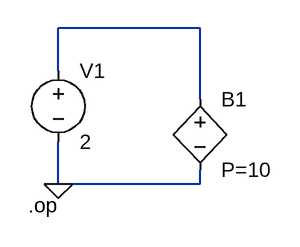
[diagram p0: schematic Constant-Power-Load.asc]
Constant-Power-Load.asc, the LTspice schematic file:
Version 4
SHEET 1 880 680
WIRE 176 64 16 64
WIRE 16 112 16 64
WIRE 176 144 176 64
WIRE 16 240 16 192
WIRE 176 240 176 224
WIRE 176 240 16 240
FLAG 16 240 0
SYMBOL voltage 16 96 R0
WINDOW 123 0 0 Left 0
WINDOW 39 0 0 Left 0
SYMATTR InstName V1
SYMATTR Value 2
SYMBOL bv 176 128 R0
SYMATTR InstName B1
SYMATTR Value P=10
TEXT -18 264 Left 2 !.op

The netlist it stands for:
* Constant-Power-Load.asc
V1 N001 0 2
B1 N001 0 P=10
.op
.backanno
.end